# Altium schematic sheet USBPD.SchDoc: USB PD negotiator
size 292 x 193 mm; CheckedBy: Jakub Howors; Author: Łukasz Gójski; CompanyName: Politechnika Warszawska; DrawnBy: Łukasz Gójski; Organization: EITI; Address1: Nowowiejska 15/19; Address2: 00-665 Warszawa; SheetNumber: 3; SheetTotal: 13; NazwaPliku: USBPD; HTTPLink: www.pw.edu.pl
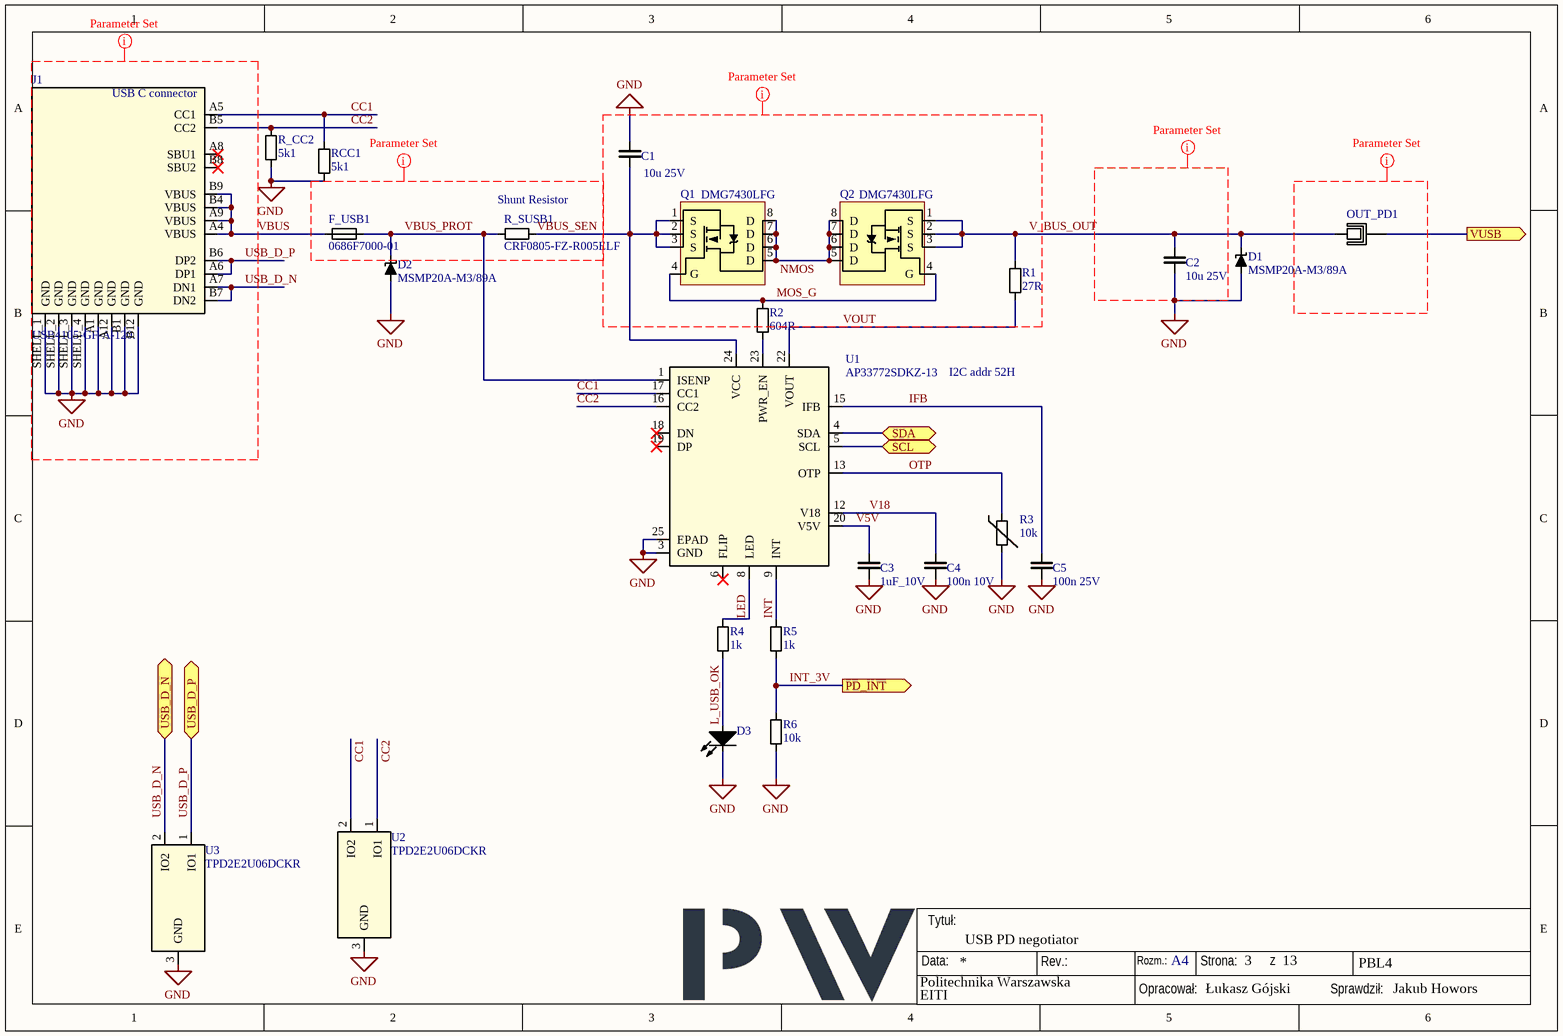
[diagram p0: USBPD.SchDoc]

## Parts
C1  10u 25V  [C_0805]
C2  10u 25V  [C_0805]
C3  1uF_10V  [C_0603]
C4  100n 10V  [C_0603]
C5  100n 25V  [C_0603]
D1  MSMP20A-M3/89A  [CR_0A-M389A_VIS]
D2  MSMP20A-M3/89A  [CR_0A-M389A_VIS]
D3  RED  [LED_0603]  (value not drawn)
F_USB1  0686F7000-01  [0603_FUSE]
J1  USB4105-GF-A-120.  [CONN_USB4105-xx-A-xxx_GCT]
OUT_PD1  JUMPER  [Jumper]  (value not drawn)
Q1  DMG7430LFG  [PowerDI3333-8]
Q2  DMG7430LFG  [PowerDI3333-8]
R1  27R  [R_0603]
R2  604R  [R_0603]
R3  10k  [R_0603]
R4  1k  [R_0603]
R5  1k  [R_0603]
R6  10k  [R_0603]
R_CC2  5k1  [R_0603]
R_SUSB1  CRF0805-FZ-R005ELF  [R_0805]
RCC1  5k1  [R_0603]
U1  AP33772SDKZ-13  [W-QFN4040-24_Type_A1_DIO-M]
U2  TPD2E2U06DCKR  [DCK0003A-MFG]
U3  TPD2E2U06DCKR  [DCK0003A-MFG]

## Ports
PD_INT (out, see PowerAssembly[2A]), SCL (bidir, see PowerAssembly[1A], ADCHighVoltageInputsSchDoc[2A], DAC[3C], DCDCreg[2C], GPIOExpander[2B], PWMExpander[2B]), SDA (bidir, see PowerAssembly[1A], ADCHighVoltageInputsSchDoc[2A], DAC[3C], DCDCreg[2C], GPIOExpander[2B], PWMExpander[2A]), USB_D_N (bidir, see PowerAssembly[1A], MCU[1A], PowerAssembly[1A]), USB_D_P (bidir, see PowerAssembly[1A], MCU[1B], PowerAssembly[1A]), VUSB (out, see PowerAssembly[2A])

## Nets
GND: C1.2 C2.1 C3.1 C4.1 C5.1 D1.A D2.A D3.K J1.A1(GND) J1.A12(GND) J1.B1(GND) J1.B12(GND) J1.SHELL_1(GND) J1.SHELL_2(GND) J1.SHELL_3(GND) J1.SHELL_4(GND) R3.1 R6.1 R_CC2.1 RCC1.1 U1.3(GND) U1.25(EPAD) U2.3(GND) U3.3(GND)
CC1: J1.A5(CC1) RCC1.2 U1.17(CC1) U2.2(IO2)
CC2: J1.B5(CC2) R_CC2.2 U1.16(CC2) U2.1(IO1)
IFB: C5.2 U1.15(IFB)
INT: R5.2 U1.9(INT)
INT_3V: R5.1 R6.2 ; port PD_INT
L_USB_OK: D3.A R4.1
LED: R4.2 U1.8(LED)
MOS_G: Q1.4(G) Q2.4(G) R2.2
NMOS: Q1.5(D) Q1.6(D) Q1.7(D) Q1.8(D) Q2.5(D) Q2.6(D) Q2.7(D) Q2.8(D)
OTP: R3.2 U1.13(OTP)
SCL: U1.5(SCL) ; port SCL
SDA: U1.4(SDA) ; port SDA
USB_D_N: J1.A7(DN1) J1.B7(DN2) U3.2(IO2) ; port USB_D_N
USB_D_P: J1.A6(DP1) J1.B6(DP2) U3.1(IO1) ; port USB_D_P
V5V: C3.2 U1.20(V5V)
V18: C4.2 U1.12(V18)
V_BUS_OUT: C2.2 D1.K OUT_PD1.1 Q2.1(S) Q2.2(S) Q2.3(S) R1.2
VBUS: F_USB1.1 J1.A4(VBUS) J1.A9(VBUS) J1.B4(VBUS) J1.B9(VBUS)
VBUS_PROT: D2.K F_USB1.2 R_SUSB1.1 U1.1(ISENP)
VBUS_SEN: C1.1 Q1.1(S) Q1.2(S) Q1.3(S) R_SUSB1.2 U1.24(VCC)
VOUT: R1.1 U1.22(VOUT)
VUSB: OUT_PD1.2 ; port VUSB
NetR2_1: R2.1 U1.23(PWR_EN)

Not connected (* = marked no-connect by the designer): J1 A8(SBU1)* B8(SBU2)*; U1 2(NC) 6(FLIP)* 7(NC) 10(NC) 11(NC) 14(NC) 18(DN)* 19(DP)* 21(NC)

## Layout directives
CompClassName: NoRelief: (no net found under the mark), GND, MOS_G, NMOS, USB_D_N, USB_D_P, V_BUS_OUT, VBUS, VBUS_PROT, VBUS_SEN, VOUT

## Notes on the sheet
- (near R_SUSB1) Shunt Resistor
- I2C addr 52H
- Data:
- Tytuł:
- Rev.:
- Rozm.:
- A4
- Strona:
- z
- PBL4
- Opracował:
- Sprawdził:
- (in symbol USB4105-GF-A-120.) USB C connector

## Library data of the parts
C1 C2 = C_10uF_25V: Ceramic capacitor; Casing: 0805; Dielectric: X5R; Tolerance: 10%; Value: 10u; Voltage: 25V; Technology: Ceramic
C3 = C_1uF_10V: Ceramic capacitor; Value: 1u; Voltage: 10V; Casing: 0603; Dielectric: X7R; Tolerance: 10%; Technology: Ceramic
C4 = C_100nF_10V: Ceramic capacitor; Casing: 0603; Dielectric: X7R; Tolerance: 10%; Value: 100n; Voltage: 10V; Technology: Ceramic
C5 = C_100nF_25V: Ceramic capacitor; Casing: 0603; Dielectric: X7R; Tolerance: 10%; Value: 100n; Voltage: 25V; Technology: Ceramic
D1 D2 = TVS_22V: 22V Breakdown MSMP20A-M3/89A; ComponentLink1Description: Datasheet; ComponentLink1URL: https://www.bourns.com/docs/product-datasheets/smbj.pdf; ComponentLink2Description: Supplier; ComponentLink2URL: https://www.mouser.pl/ProductDetail/Bourns/SMBJ22A?qs=%252Bf8Cd6aE5bxYX21zv65pDQ%3D%3D; Value: 22V
D3 = LED_0603: LED RED 0603 3.3V; Casing: 0603; Color: RED
F_USB1 = F_7A: 7A fuse 0603 package; Manufacturer: Bel fuse Inc.; Current: 7A
J1 = USB4105-GF-A-120.: USB - C connector  16 pin, 100W, famale paraller to board; pin to pad: SHELL_1>17 SHELL_2>18 SHELL_3>19 SHELL_4>20; Manufacturer: Global Connector Technology; Manufacturer_Part_Number: USB4105-GF-A-120.; Power: 100W
OUT_PD1 = Jumper x2: Jumper on traces
Q1 Q2 = NMOS_DMG7430LFG: DMG7430LFG, N-mosfet; Manufacturer: Diodes Incorporated; Casing: 8-PowerVDFN
R1 = R_27R: Resistor; Tolerance: 1%; Power: 100mW; Casing: 0603; Value: 27R
R2 = R_604R: Resistor; Tolerance: 1%; Power: 100mW; Casing: 0603; Value: 604R
R3 = R_NTC_10k_25C: NTC Thermistor, 10k; Casing: 0603; Tolerance: 1%; Value: 10k
R4 R5 = R_1k: Resistor; Tolerance: 1%; Power: 100mW; Casing: 0603; Value: 1k
R6 = R_10k: Resistor; Tolerance: 1%; Power: 100mW; Casing: 0603; Value: 10k
R_CC2 RCC1 = R_5k1: Resistor; Tolerance: 1%; Power: 100mW; Casing: 0603; Value: 5k1
R_SUSB1 = R_5mR: Shunt Resistor 5mR, 0805; Tolerance: 1%; Power: 500mW; Casing: 0805; Value: 5mR
U1 = AP33772SDKZ-13: USB_C PD controller; Manufacturer: Diodes Inc; Manufacturer_Part_Number: AP33772SDKZ-13
U2 U3 = TPD2E2U06DCKR: Dual 1.5-pF, 5.5-V, ±25-kV  ESD protection diode with 5.5-A 8/20-uS surge rating  for USB 2.0 3-SC70; Manufacturer: Texas Instruments; Manufacturer_Part_Number: TPD2E2U06DCKR